# EAGLE design SHT21_breakout (EAGLE 7.3.0)
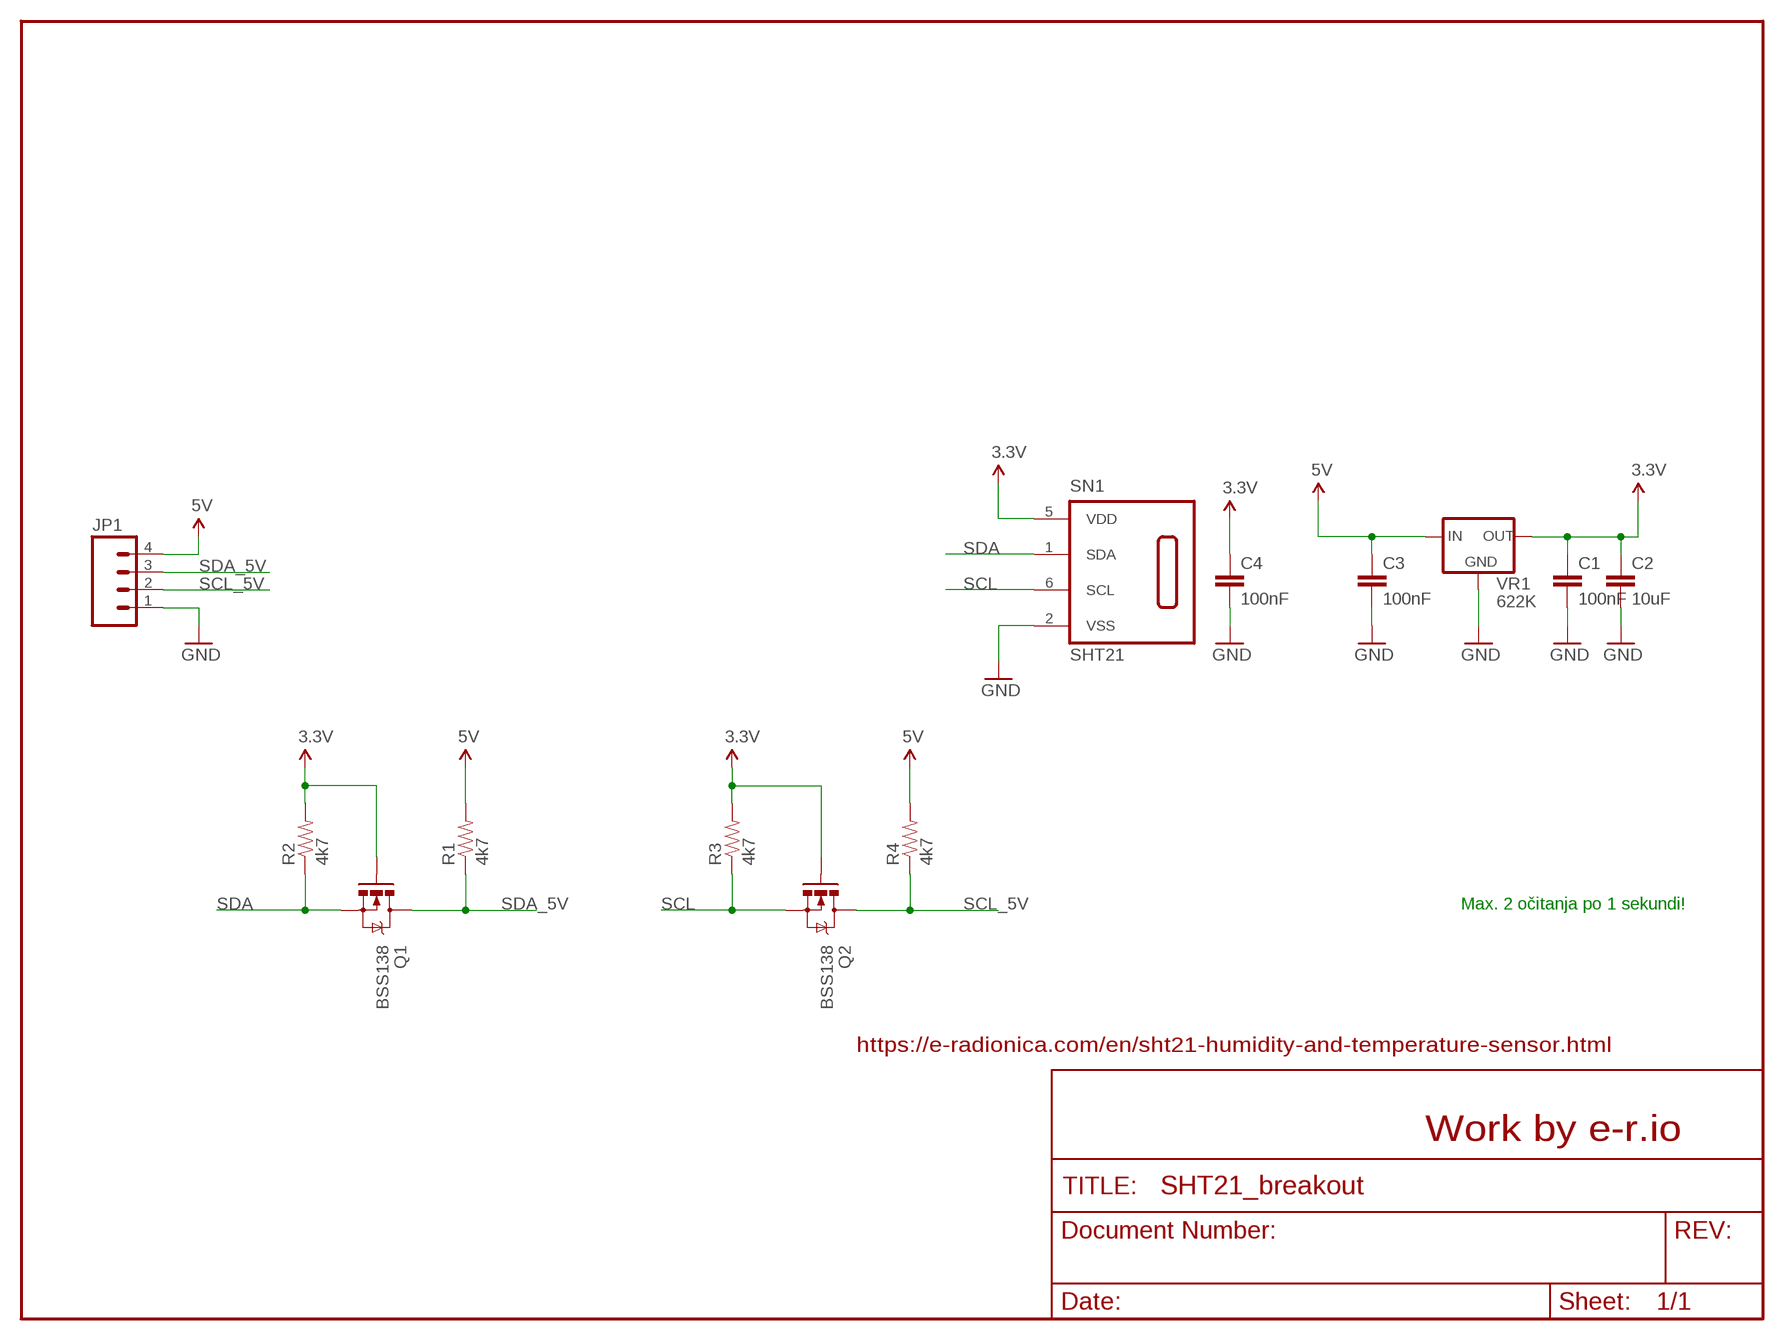
[diagram p0: schematic, sheet 1]

## Parts
C1  100nF  CAP0603-CAP  [0603-CAP]
C2  10uF  CAP1206  [1206]
C3  100nF  CAP0603-CAP  [0603-CAP]
C4  100nF  CAP0603-CAP  [0603-CAP]
JP1  M04PTH  [1X04]
Q1  BSS138  MOSFET-NCHANNELSMD  [SOT23-3]
Q2  BSS138  MOSFET-NCHANNELSMD  [SOT23-3]
R1  4k7  RESISTOR0603-RES  [0603-RES]
R2  4k7  RESISTOR0603-RES  [0603-RES]
R3  4k7  RESISTOR0603-RES  [0603-RES]
R4  4k7  RESISTOR0603-RES  [0603-RES]
SN1  SHT21  [DFN6/SHT]
VR1  622K  [662K]

## Nets
3.3V: C1.1 C2.1 C4.1 Q1.1(G) Q2.1(G) R2.2 R3.2 SN1.5(VDD) VR1.OUT
5V: C3.1 JP1.4 R1.2 R4.2 VR1.IN
GND: C1.2 C2.2 C3.2 C4.2 JP1.1 SN1.2(VSS) VR1.GND
SCL: Q2.2(S) R3.1 SN1.6(SCL)
SCL_5V: JP1.2 Q2.3(D) R4.1
SDA: Q1.2(S) R2.1 SN1.1(SDA)
SDA_5V: JP1.3 Q1.3(D) R1.1

## Notes on the sheet
- Max. 2 očitanja po 1 sekundi!
- https://e-radionica.com/en/sht21-humidity-and-temperature-sensor.html
- Work by e-r.io

## Library data of the parts
C1-C4 = SparkFun:CAP: Capacitor Standard 0603 ceramic capacitor, and 0.1" leaded capacitor.
JP1 = SparkFun:M04: Header 4 Standard 4-pin 0.1" header. Use with straight break away headers (SKU : PRT-00116), right angle break away headers (PRT-00553), swiss pins (PRT-00743), machine pins (PRT-00117), and female headers (PRT-00115). Molex polarized connector foot print use with SKU : PRT-08231 with associated crimp pins and housings. 1MM SMD Version SKU: PRT-10208
Q1 Q2 = SparkFun:MOSFET-NCHANNEL
R1-R4 = SparkFun:RESISTOR: Resistor Basic schematic elements and footprints for 0603, 1206, and PTH resistors.
SN1 = sensirion:SHT21: Humidity and Temperature Sensor
VR1 = SparkFun:622K

## Board
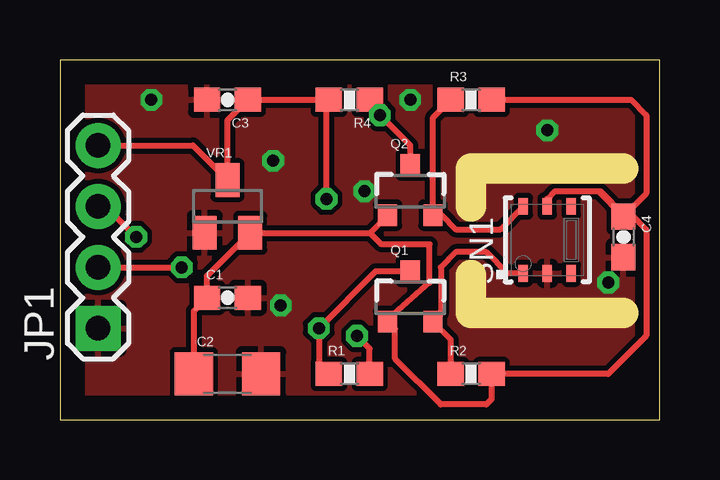
[diagram p1: board, top side]
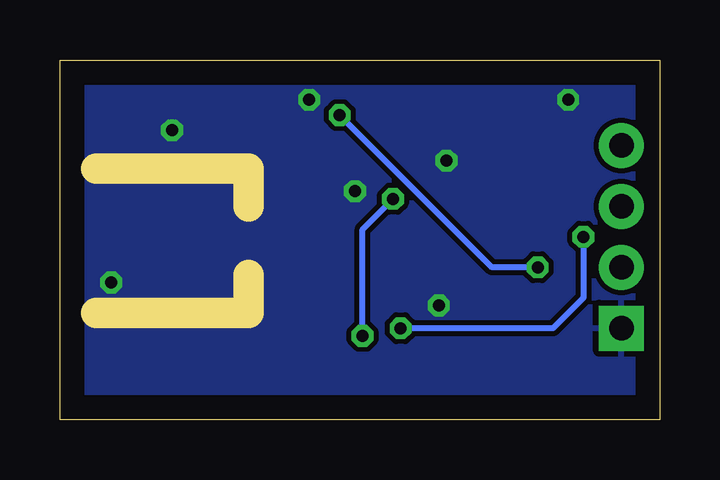
[diagram p2: board, bottom side, seen from below]

Size 25 x 15 mm. Coordinates in mm from the lower left corner, seen from the top.
Outline: 0,0 25,0 25,15 0,15 0,0
Copper layers (1*16): Top 0.035mm / dielectric 1.5mm / Bottom 0.035mm
Design rules "default *": minimum track width 10mil, minimum drill 24mil, track to track 8mil, track to pad 8mil, pad to pad 8mil, via to via 8mil, smd to smd 8mil, copper to edge 40mil, drill to drill 8mil, minimum pad ring 10mil, minimum via ring 8mil, stop-mask expansion 4mil, vias tented up to drill 5mm, thermal gap 10mil
Milling: 4 lines

### Footprints (pad centres in the part's own frame; a part is rotated, then mirrored left to right if it is on the bottom)
0603-CAP = smd 1.1 x 1: 1 -0.85,0; 2 0.85,0
1206 = smd 1.6 x 1.8: 1 -1.4,0; 2 1.4,0
1X04 = drill 1.016 pad 1.88 square: 1 0,0 | drill 1.016 pad 1.88: 2 2.54,0; 3 5.08,0; 4 7.62,0
SOT23-3 = smd 0.8 x 0.9: 1 -0.95,-1; 2 0.95,-1; 3 0,1.1
0603-RES = smd 1.1 x 1: 1 -0.85,0; 2 0.85,0
DFN6/SHT = smd 0.4 x 0.7: 1 -1,-1.4; 2 0,-1.4; 3 1,-1.4; 4 1,1.4; 5 0,1.4; 6 -1,1.4
662K = smd 1 x 1.4: GND -0.95,-1.1; IN 0,1.1; OUT 0.95,-1.1

### Placement (x,y rotation side)
C1  6.99,5.08 0 top
C2  6.99,1.91 0 top
C3  6.99,13.34 180 top
C4  23.5,7.62 270 top
JP1  1.59,3.81 90 top
Q1  14.61,5.08 0 top
Q2  14.61,9.53 0 top
R1  12.06,1.91 0 top
R2  17.14,1.91 0 top
R3  17.14,13.34 0 top
R4  12.06,13.34 180 top
SN1  20.32,7.5 0 top
U$1  [LUDI_LOGO_BACK]  5.71,2.86 0 top
U$6  [NOVI_LOGO-4MM]  8.89,4.45 0 top
U$7  [OSH3MM]  21.59,11.43 0 top
U$8  [E-RADIONICA.COM_MADE_IN_BACK!]  5.4,0.32 0 top
VR1  6.99,8.89 0 top

### Tracks (layer width: path | path; a pad name or v marks a point on that pad's centre or on a via)
3.3V
  Top 0.254: C2.1 5.58,4.53 C1.1 6.13,5.99 VR1.OUT 12.92,7.79 | 12.92,7.79 Q2.1 | 12.92,7.79 13.41,7.3 15.41,7.3 15.41,5.71 13.92,4.4 13.92,4.08 Q1.1 13.97,3.77 13.97,2.54 15.88,0.64 17.78,0.64 18,0.85 R2.2 22.86,1.91 24.45,3.49 24.45,7.94 23.81,8.57 23.5,8.57 22.54,9.53 22.44,9.53 | R3.2 23.81,13.34 24.45,12.7 24.45,9.42 C4.1 22.44,9.53 | 22.44,9.53 20.64,9.53 20.32,9.21 SN1.5
5V  (via drill 0.5)
  Top 0.254: JP1.4 5.54,11.43 VR1.IN 6.99,12.48 C3.1 R4.2 11.11,13.23 v11.11,9.21 | R1.2 12.91,2.96 v12.38,3.49
  Bottom 0.254: v12.38,3.49 12.38,7.94 v11.11,9.21
GND  (via drill 0.5)
  other vias: 8.89,10.79 9.21,4.76 3.81,13.34 20.32,12.06 22.86,5.71 14.61,13.34 12.7,9.53
  pour Top: 0,0 25.08,0 25.08,14.92 0,14.92
  pour Bottom: 0,0 25.08,0 25.08,14.92 0,14.92
SCL
  Top 0.254: R3.1 15.55,12.6 Q2.2 15.92,8.53 16.51,7.94 18.36,7.94 SN1.6
SCL_5V  (via drill 0.5)
  Top 0.254: JP1.2 v5.08,6.35 | R4.1 13.34,12.91 v13.34,12.7 14.61,11.43 Q2.3
  Bottom 0.254: v5.08,6.35 6.99,6.35 v13.34,12.7
SDA
  Top 0.254: R2.1 16.3,3.34 Q1.2 15.88,4.4 15.88,6.35 16.51,6.99 17.78,6.99 18.66,6.1 SN1.1
SDA_5V  (via drill 0.5)
  Top 0.254: JP1.3 1.91,8.89 v3.17,7.62 | R1.1 10.79,2.33 v10.79,3.81 13.16,6.18 Q1.3
  Bottom 0.254: v3.17,7.62 3.17,5.08 4.45,3.81 v10.79,3.81

### Text on the board
200bmp: SHT21 | SHT21 / breakout | 5V IIC / logic
208bmp: +5V | SDA | SCL | gnd